# EAGLE design OSO-SCAP-A1-00 (EAGLE 9.4.2)
COMPANY: ADAFRUIT INDUSTRIES; DRAWN: KTOWN; REV: B
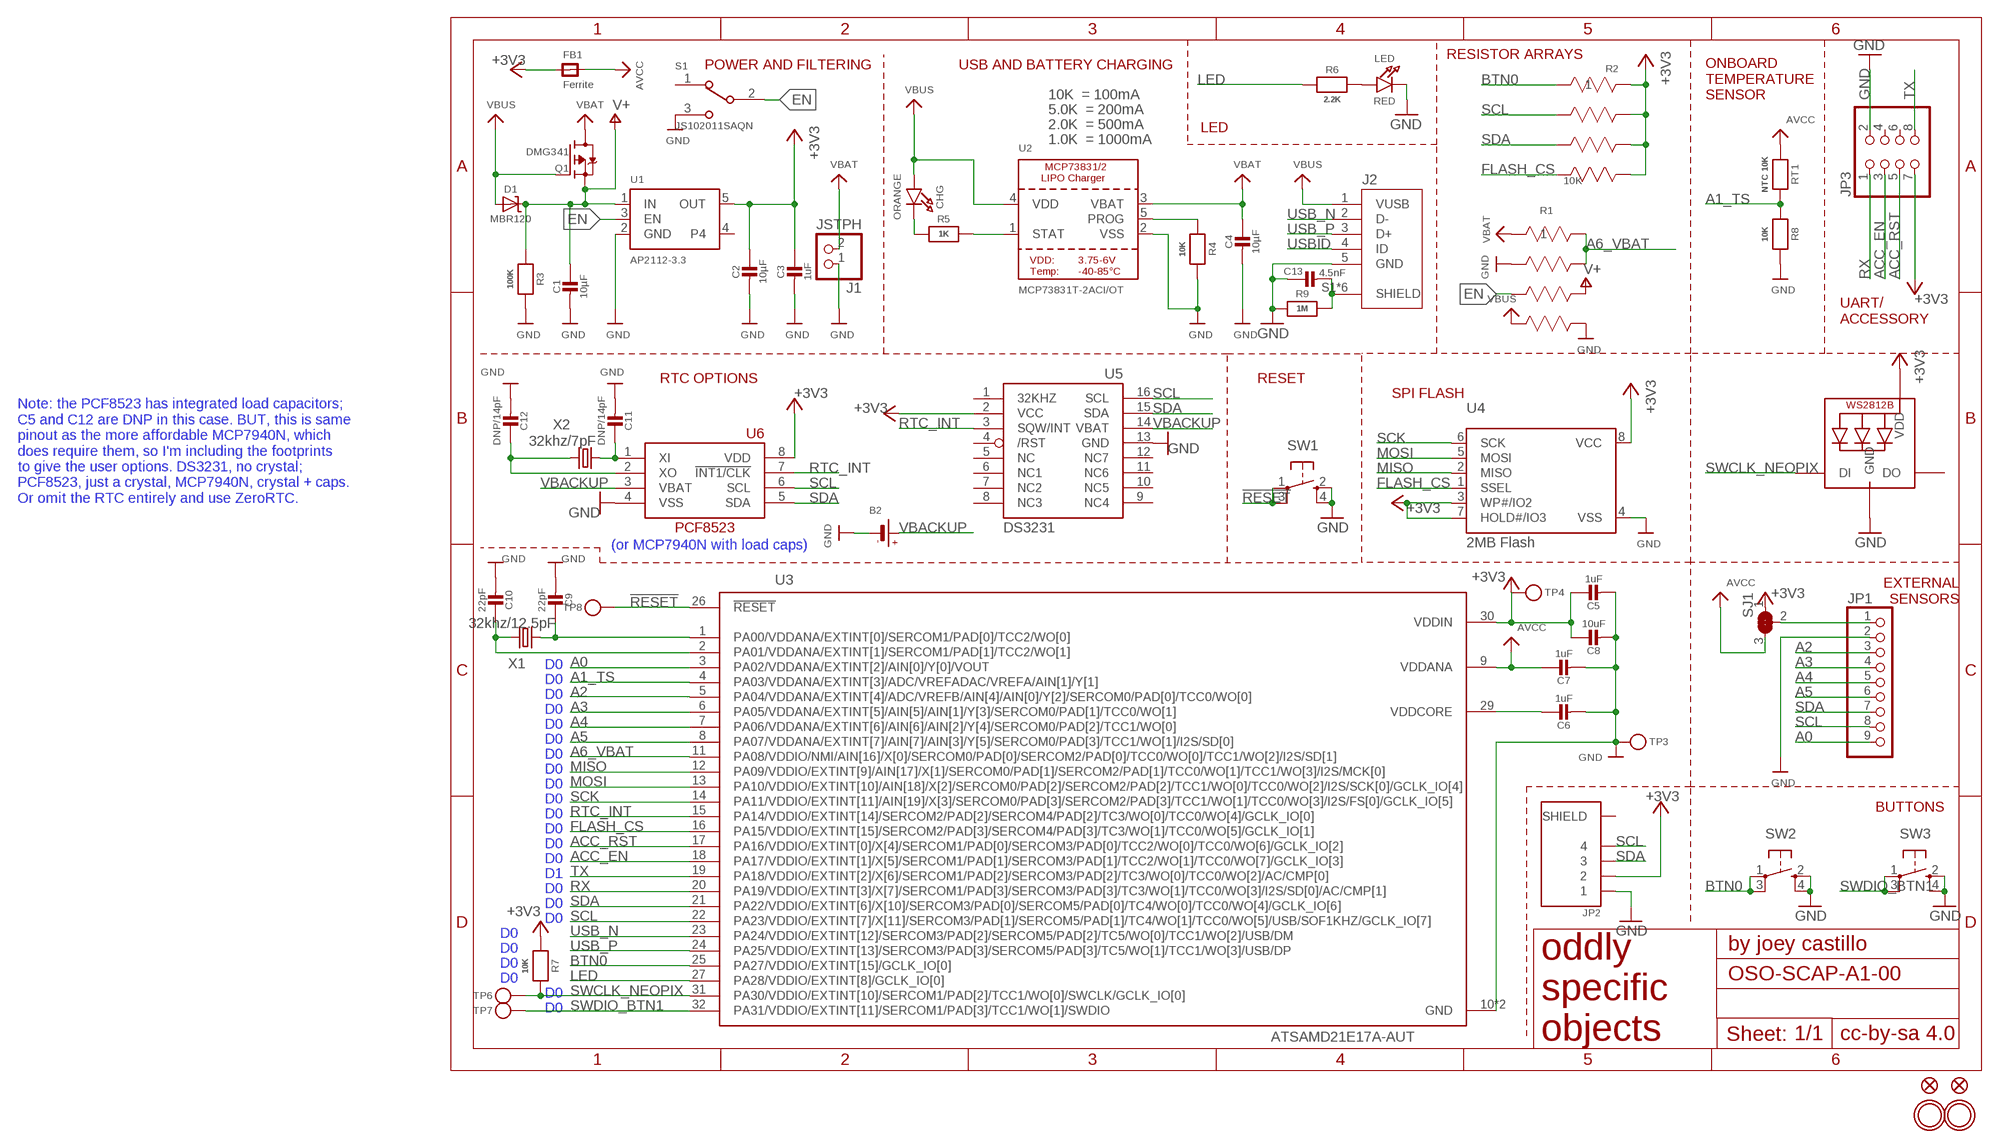
[diagram p0: schematic, sheet 1]

## Parts
B2  CR1220  BATTERYCR1220_2  [CR1220-2]
C1  10µF  CAP_CERAMIC0805_10MGAP  [0805_10MGAP]
C2  10µF  CAP_CERAMIC0805-NOOUTLINE  [0805-NO]
C3  1uF  CAP_CERAMIC0805-NOOUTLINE  [0805-NO]
C4  10µF  CAP_CERAMIC0805-NOOUTLINE  [0805-NO]
C5  1uF  CAP_CERAMIC0805-NOOUTLINE  [0805-NO]
C6  1uF  CAP_CERAMIC0805-NOOUTLINE  [0805-NO]
C7  1uF  CAP_CERAMIC0805-NOOUTLINE  [0805-NO]
C8  10uF  CAP_CERAMIC0805-NOOUTLINE  [0805-NO]
C9  22pF  CAP_CERAMIC0805-NOOUTLINE  [0805-NO]
C10  22pF  CAP_CERAMIC0805-NOOUTLINE  [0805-NO]
C11  DNP/14pF  CAP_CERAMIC0805_10MGAP  [0805_10MGAP]
C12  DNP/14pF  CAP_CERAMIC0805_10MGAP  [0805_10MGAP]
C13  4.5nF  CAP_CERAMIC0805-NOOUTLINE  [0805-NO]
CHG  ORANGE  LED0805_NOOUTLINE  [CHIPLED_0805_NOOUTLINE]
D1  MBR120  DIODE-SCHOTTKYSOD-123  [SOD-123]
FB1  Ferrite  FERRITE0805  [0805]
J1  JSTPH  CON_JST_PH_2PIN  [JSTPH2]
J2  10118193-0001LF  [FCI_10118193-0001LF]
JP1  HEADER-1X9_JSTSH  [JST_SH9]
JP2  SM04B-SRSS-TB(LF)(SN)  [JST_SM04B-SRSS-TB(LF)(SN)]
JP3  PINHD-2X4SMT  [PINHD_2X4_SMT]
LED  RED  LED0805_NOOUTLINE  [CHIPLED_0805_NOOUTLINE]
NEOPIX  WS2812B_4020  [WS2812B_4020]
Q1  DMG341  MOSFET-P  [SOT23-R]
R1  100K  EXB-V8V103JV  [EXBV8V]
R2  10K  EXB-V8V103JV  [EXBV8V]
R3  100K  RESISTOR0805_NOOUTLINE  [0805-NO]
R4  10K  RESISTOR0805_NOOUTLINE  [0805-NO]
R5  1K  RESISTOR0805_NOOUTLINE  [0805-NO]
R6  2.2K  RESISTOR0805_NOOUTLINE  [0805-NO]
R7  10K  RESISTOR0805_NOOUTLINE  [0805-NO]
R8  10K  RESISTOR0805_NOOUTLINE  [0805-NO]
R9  1M  RESISTOR0805_NOOUTLINE  [0805-NO]
RT1  NTC 10K  RESISTOR0805_NOOUTLINE  [0805-NO]
S1  JS102011SAQN  [SW_JS102011SAQN]
SJ1  SOLDERJUMPER_2WAY  [SOLDERJUMPER_2WAY_OPEN_NOPASTE]
SW1  SPST_TACT-KMR2  [KMR2]
SW2  SPST_TACT-KMR2  [KMR2]
SW3  SPST_TACT-KMR2  [KMR2]
TP3  TESTPOINTROUND2MMNO  [TESTPOINT_ROUND_2MM_NO]
TP4  TESTPOINTROUND2MMNO  [TESTPOINT_ROUND_2MM_NO]
TP6  TESTPOINTROUND2MMNO  [TESTPOINT_ROUND_2MM_NO]
TP7  TESTPOINTROUND2MMNO  [TESTPOINT_ROUND_2MM_NO]
TP8  TESTPOINTROUND2MMNO  [TESTPOINT_ROUND_2MM_NO]
U1  AP2112-3.3  VREG_SOT23-5  [SOT23-5]
U2  MCP73831T-2ACI/OT  MCP73831/2  [SOT23-5]
U3  ATSAMD21E17A-AUT  [QFP80P900X900X120-32N]
U4  2MB Flash  SPIFLASH_SOIC8208MIL  [SOIC8_208MIL]
U5  DS3231/SO  [SO16W]
U6  PCF8523T  RTC_PCF8523T  [SOIC8_150MIL]
U$31  MOUNTINGHOLE2.5  [MOUNTINGHOLE_2.5_PLATED]
U$32  MOUNTINGHOLE2.5  [MOUNTINGHOLE_2.5_PLATED]
U$34  FIDUCIAL""  [FIDUCIAL_1MM]
U$35  FIDUCIAL""  [FIDUCIAL_1MM]
X1  32khz/12.5pF  CRYSTAL7015  [XTAL-7015]
X2  32khz/7pF  CRYSTAL7015  [XTAL-7015]

## Nets
!RESET: SW1.1(P) SW1.3(P1) TP8.P$1 U3.26(!RESET)
+3V3 [power]: C2.1 C3.1 C5.1 C8.1 FB1.1 JP2.2 JP3.7 NEOPIX.2(VDD) R2.5 R2.6 R2.7 R2.8 R7.1 SJ1.1 TP4.P$1 U1.5(OUT) U3.30(VDDIN) U4.3(WP#/IO2) U4.7(HOLD#/IO3) U4.8(VCC) U5.2(VCC) U6.8(VDD)
A0: JP1.9 U3.3(PA02/VDDANA/EXTINT[2]/AIN[0]/Y[0]/VOUT)
A1_TS: R8.1 RT1.2 U3.4(PA03/VDDANA/EXTINT[3]/ADC/VREFADAC/VREFA/AIN[1]/Y[1])
A2: JP1.3 U3.5(PA04/VDDANA/EXTINT[4]/ADC/VREFB/AIN[4]/AIN[0]/Y[2]/SERCOM0/PAD[0]/TCC0/WO[0])
A3: JP1.4 U3.6(PA05/VDDANA/EXTINT[5]/AIN[5]/AIN[1]/Y[3]/SERCOM0/PAD[1]/TCC0/WO[1])
A4: JP1.5 U3.7(PA06/VDDANA/EXTINT[6]/AIN[6]/AIN[2]/Y[4]/SERCOM0/PAD[2]/TCC1/WO[0])
A5: JP1.6 U3.8(PA07/VDDANA/EXTINT[7]/AIN[7]/AIN[3]/Y[5]/SERCOM0/PAD[3]/TCC1/WO[1]/I2S/SD[0])
A6_VBAT: R1.7 R1.8 U3.11(PA08/VDDIO/NMI/AIN[16]/X[0]/SERCOM0/PAD[0]/SERCOM2/PAD[0]/TCC0/WO[0]/TCC1/WO[2]/I2S/SD[1])
ACC_EN: JP3.3 U3.18(PA17/VDDIO/EXTINT[1]/X[5]/SERCOM1/PAD[1]/SERCOM3/PAD[1]/TCC2/WO[1]/TCC0/WO[7]/GCLK_IO[3])
ACC_RST: JP3.5 U3.17(PA16/VDDIO/EXTINT[0]/X[4]/SERCOM1/PAD[0]/SERCOM3/PAD[0]/TCC2/WO[0]/TCC0/WO[6]/GCLK_IO[2])
AVCC: C7.1 FB1.2 RT1.1 SJ1.3 U3.9(VDDANA)
BTN0: R2.1 SW2.1(P) SW2.3(P1) U3.25(PA27/VDDIO/EXTINT[15]/GCLK_IO[0])
EN: R1.3 S1.2 U1.3(EN)
FLASH_CS: R2.4 U3.16(PA15/VDDIO/EXTINT[15]/SERCOM2/PAD[3]/SERCOM4/PAD[3]/TC3/WO[1]/TCC0/WO[5]/GCLK_IO[1]) U4.1(SSEL)
GND [gnd]: B2.- C1.2 C2.2 C3.2 C4.2 C5.2 C6.2 C7.2 C8.2 C9.2 C10.2 C11.2 C12.2 C13.1 J1.1 J2.5(GND) JP1.2 JP2.1 JP3.2 LED.C NEOPIX.4(GND) R1.2 R1.5 R3.2 R4.2 R8.2 R9.1 S1.3 SW1.2(S) SW1.4(S1) SW2.2(S) SW2.4(S1) SW3.2(S) SW3.4(S1) TP3.P$1 U1.2(GND) U2.2(VSS) U3.10(GND) U3.28(GND) U4.4(VSS) U5.13(GND) U6.4(VSS)
LED: R6.1 U3.27(PA28/VDDIO/EXTINT[8]/GCLK_IO[0])
MISO: U3.12(PA09/VDDIO/EXTINT[9]/AIN[17]/X[1]/SERCOM0/PAD[1]/SERCOM2/PAD[1]/TCC0/WO[1]/TCC1/WO[3]/I2S/MCK[0]) U4.2(MISO)
MOSI: U3.13(PA10/VDDIO/EXTINT[10]/AIN[18]/X[2]/SERCOM0/PAD[2]/SERCOM2/PAD[2]/TCC1/WO[0]/TCC0/WO[2]/I2S/SCK[0]/GCLK_IO[4]) U4.5(MOSI)
N$1: CHG.C R5.1
N$2: LED.A R6.2
POWER_OUT [power]: JP1.1 SJ1.2
PROG: R4.1 U2.5(PROG)
RTC_INT: U3.15(PA14/VDDIO/EXTINT[14]/SERCOM2/PAD[2]/SERCOM4/PAD[2]/TC3/WO[0]/TCC0/WO[4]/GCLK_IO[0]) U5.3(SQW/INT) U6.7(!INT1/CLK)
RX: JP3.1 U3.20(PA19/VDDIO/EXTINT[3]/X[7]/SERCOM1/PAD[3]/SERCOM3/PAD[3]/TC3/WO[1]/TCC0/WO[3]/I2S/SD[0]/AC/CMP[1])
SCK: U3.14(PA11/VDDIO/EXTINT[11]/AIN[19]/X[3]/SERCOM0/PAD[3]/SERCOM2/PAD[3]/TCC1/WO[1]/TCC0/WO[3]/I2S/FS[0]/GCLK_IO[5]) U4.6(SCK)
SCL: JP1.8 JP2.4 R2.2 U3.22(PA23/VDDIO/EXTINT[7]/X[11]/SERCOM3/PAD[1]/SERCOM5/PAD[1]/TC4/WO[1]/TCC0/WO[5]/USB/SOF1KHZ/GCLK_IO[7]) U5.16(SCL) U6.6(SCL)
SDA: JP1.7 JP2.3 R2.3 U3.21(PA22/VDDIO/EXTINT[6]/X[10]/SERCOM3/PAD[0]/SERCOM5/PAD[0]/TC4/WO[0]/TCC0/WO[4]/GCLK_IO[6]) U5.15(SDA) U6.5(SDA)
SHIELD: C13.2 J2.S1(SHIELD) J2.S2(SHIELD) J2.S3(SHIELD) J2.S4(SHIELD) J2.S5(SHIELD) J2.S6(SHIELD) R9.2
STAT: R5.2 U2.1(STAT)
SWCLK_NEOPIX: NEOPIX.1(DI) R7.2 TP6.P$1 U3.31(PA30/VDDIO/EXTINT[10]/SERCOM1/PAD[2]/TCC1/WO[0]/SWCLK/GCLK_IO[0])
SWDIO_BTN1: SW3.1(P) SW3.3(P1) TP7.P$1 U3.32(PA31/VDDIO/EXTINT[11]/SERCOM1/PAD[3]/TCC1/WO[1]/SWDIO)
TX: JP3.8 U3.19(PA18/VDDIO/EXTINT[2]/X[6]/SERCOM1/PAD[2]/SERCOM3/PAD[2]/TC3/WO[0]/TCC0/WO[2]/AC/CMP[0])
USB_N: J2.2(D-) U3.23(PA24/VDDIO/EXTINT[12]/SERCOM3/PAD[2]/SERCOM5/PAD[2]/TC5/WO[0]/TCC1/WO[2]/USB/DM)
USB_P: J2.3(D+) U3.24(PA25/VDDIO/EXTINT[13]/SERCOM3/PAD[3]/SERCOM5/PAD[3]/TC5/WO[1]/TCC1/WO[3]/USB/DP)
USBID: J2.4(ID)
V+ [power]: C1.1 D1.C Q1.2(S) R1.6 R3.1 U1.1(IN)
VBACKUP: B2.+ U5.14(VBAT) U6.3(VBAT)
VBAT [power]: C4.1 J1.2 Q1.3(D) R1.1 U2.3(VBAT)
VBUS [power]: CHG.A D1.A J2.1(VUSB) Q1.1(G) R1.4 U2.4(VDD)
VDDCORE: C6.1 U3.29(VDDCORE)
XIN32: C9.1 U3.1(PA00/VDDANA/EXTINT[0]/SERCOM1/PAD[0]/TCC2/WO[0]) X1.1
XIN_RTC: C11.1 U6.1(XI) X2.1
XOUT32: C10.1 U3.2(PA01/VDDANA/EXTINT[1]/SERCOM1/PAD[1]/TCC2/WO[1]) X1.4
XOUT_RTC: C12.1 U6.2(XO) X2.4
Unconnected: JP2.S1(SHIELD) JP2.S2(SHIELD) JP3.4 JP3.6 NEOPIX.3(DO) S1.1 U1.4 U5.1(32KHZ) U5.4(/RST) U5.5(NC) U5.6(NC1) U5.7(NC2) U5.8(NC3) U5.9(NC4) U5.10(NC5) U5.11(NC6) U5.12(NC7)

## Notes on the sheet
- RESISTOR ARRAYS
- POWER AND FILTERING | USB AND BATTERY CHARGING
- 10K  = 100mA
- ONBOARD
  TEMPERATURE
  SENSOR
- 5.0K  = 200mA
- 2.0K  = 500mA | LED
- 1.0K  = 1000mA
- UART/
  ACCESSORY
- RTC OPTIONS | RESET
- Note: the PCF8523 has integrated load capacitors; 
  C5 and C12 are DNP in this case. BUT, this is same 
  pinout as the more affordable MCP7940N, which 
  does require them, so I'm including the footprints 
  to give the user options. DS3231, no crystal; 
  PCF8523, just a crystal, MCP7940N, crystal + caps.
  Or omit the RTC entirely and use ZeroRTC.
- SPI FLASH
- (or MCP7940N with load caps)
- EXTERNAL
  SENSORS
- D0
- D0
- D0
- D0
- D0
- D0
- D0
- D0
- D0
- D0 | BUTTONS
- D0
- D0
- D0
- D0
- D1
- D0
- D0
- D0
- D0
- D0
- D0
- D0
- D0
- D0

## Library data of the parts
B2 = microbuilder:BATTERY: CR1220 SMT - Digikey: 3001K-ND CD2032 BAT-HLD-001 - Digikey: BAT-HLD-001-ND
C1-C13 = microbuilder:CAP_CERAMIC: Ceramic Capacitors For new designs, use the packages preceded by an '_' character since they are more reliable: The following footprints should be used on most boards: _0402 - Standard footprint for regular board layouts _0603 - Standard footprint for regular board layouts _0805 - Standard footprint for regular board layouts _1206 - Standard footprint for regular board layouts For extremely tight-pitch boards where space is at a premium, the following 'micro-pitch' footprints can be used (smaller pads, no silkscreen outline, etc.): _0402MP - Micro-pitch footprint for very dense/compact boards _0603MP - Micro-pitch footprint for very dense/compact boards _0805MP - Micro-pitch footprint for very dense/compact boards _1206MP - Micro-pitch footprint for very dense/compact boards
CHG LED = microbuilder:LED: LED 0603 - 0603 Surface Mount Package 2mA: Green LED - Low Power (3.9mcd, 2ma, 1.7Vf) - Digikey: 475-2709-2-ND Orange LED - Low Power (9.8mcd, 2ma, 1.8Vf) - Digikey: 475-1194-2-ND Red LED - Low Power (5mcd, 2ma, 1.8Vf) - Digikey: 475-1195-2-ND Yellow LED - Low Power (7mcd, 2ma, 1.8Vf) - Digikey: 475-1196-2-ND 5mA: Blue LED - Low Power (17mcd, 5ma, 2.9Vf) - Digikey: LNJ937W8CRACT-ND 0805 - 0805 Surface Mount Package 2mA: Red LED (8.8mcd, 2mA, 1.8Vf, Clear) - Low Power [Digikey: 475-2510-1-ND] Green LED (5mcd, 2mA, 1.8Vf, Clear) - Low Power [Digikey: 475-2730-1-ND] Yellow LED (11.3mcd, 2mA, 1.8Vf, Clear) - Low Power [Digikey: 475-2555-1-ND] 20mA: Red LED (104mcd, 20mA, Diffused) - LS R976 [Digikey: 475-1278-6-ND] Red LED (12mcd, 20mA, 2.0Vf, Clear) - APT2012EC [Digikey: 754-1128-1-ND] Green LED (15mcd, 20mA, 2.2Vf, Clear) - APT2012GC [Digikey: 754-1131-1-ND] Orange LED (160mcd, 20mA, 2.1Vf, Clear) - APT2012SECK [Digikey: 754-1130-1-ND] 1206 - 1206 Surface Mount Package Green LED (26mcd, 20mA, Diffused) - LG N971 [Digikey: 475-1407-6-ND] Red LED (15mcd, 20mA, Diffused) - LH N974 [Digikey: 475-1416-6-ND] Cree - Cree High-Power Surface Mount LEDs XPEBWT-L1-0000-00D50 - White 111lm 350mA 2.9Vf 6200K 110° XTEAWT-00-0000-00000LEE3 - White 114lm 350mA 2.85Vf 5000K 115° Everlight - Everlight 45-21 Series Surface Mount LEDs 45-21/QK2C-B2832AC2CB2/2T - Warm White 2000mcd 20mA 3.25Vf 3050K 120° 45-21/LK2C-B38452C4CB2/2T - Nuetral White 2000mcd 20mA 3.25Vf 4150K 120° 45-21/LK2C-B50634C6CB2/2T - Cold White 2200mcd 20mA 3.25Vf 5650K 120° PLCC2 Reverse Mount LS T77K-J1L2-1-0-2-R18-Z - Red 11.25mcd 2mA 1.8Vf 630nm 120° LO T77K-L1M2-24-Z - Orange 19.6mcd 2mA 1.8Vf 606nm 120° LY T77K-K2M1-26-Z - Yellow 15.7mcd 2mA 1.8Vf 587nm 120°
D1 = microbuilder:DIODE-SCHOTTKY
FB1 = microbuilder:FERRITE: Ferrite Bead 0603 MMZ1608B121C - 120 Ohm @ 100MHz, 600mA, 0.15 Ohm DC Resistance - Digikey: 445-2164-1-ND BK1608HW121-T - 120 Ohm, 600mA Ferrite Chip - Digikey: 587-1876-2-ND 0805 HZ0805B272R-10 - 2.7K Ohm @ 100MHz, 200mA, 0.8 Ohm DC Resistance - Digikey: 240-2504-1-ND (see also Murata BLM21BD272SN1L) MMZ2012Y152B - 1.5K Ohm @ 100MHz, 500mA, 0.4 Ohm DC Resistance - Digikey: 445-1560-1-ND - Mainly for high frequency (80-400MHz) MMZ2012R102A - 1K Ohm @ 100MHz, 500mA, 0.3 Ohm DC Resistance - Digikey: 445-1555-2-ND - More general purpose (10-200MHz)
J1 = microbuilder:CON_JST_PH_2PIN: JST 2-Pin Right-Angle Connector PH-Series - 4UConnector: 17311 SH-Series - 4UConnector: 07278
J2 = 10118193-0001LF:10118193-0001LF: Micro USB B Type Receptacle; DESCRIPTION: Single Port 5 Contact Shielded SMT MICRO USB B-Type Receptacle; DIGI-KEY_PART_NUMBER: 609-4616-1-ND; DIGI-KEY_PURCHASE_URL: https://www.digikey.com/product-detail/en/amphenol-icc-fci/10118193-0001LF/609-4616-1-ND/2785380?utm_source=snapeda&utm_medium=aggregator&utm_campaign=symbol; MF: Amphenol ICC; MP: 10118193-0001LF; PACKAGE: None
JP1 = microbuilder:HEADER-1X9: PIN HEADER
JP2 = SM04B-SRSS-TB_LF__SN_:SM04B-SRSS-TB(LF)(SN): SH Series 1.0 mm Pitch 2 Position Single Row Side Entry Shrouded Header; DESCRIPTION: SH Series 1.0 mm Pitch 2 Position Single Row Side Entry Shrouded Header; DIGI-KEY_PART_NUMBER: 455-1804-1-ND; DIGI-KEY_PURCHASE_URL: https://www.digikey.com/product-detail/en/jst-sales-america-inc/SM04B-SRSS-TB_LF__SN_/455-1804-1-ND/926875?utm_source=snapeda&utm_medium=aggregator&utm_campaign=symbol; MF: JST Sales; MP: SM04B-SRSS-TB_LF__SN_; PACKAGE: None
JP3 = My Stuff:PINHD-2X4: PIN HEADER
NEOPIX = microbuilder:WS2812B
Q1 = microbuilder:MOSFET-P: P-Channel Mosfet LEGEND VDS: Voltage Drain-Source ID: Drain Current RDS(ON): Drain-Source On-State Resistance VGS(TH): Gate-Source Threshold Voltage CISS: Drain-Source Input Capacitance SOT-23 Name VDS ID RDS(ON) VGS(TH) CISS Order Number IRLML5103 30V 760mA 600 mOhm -- 75pF @ 25V Digikey: IRLML5103PBFCT-ND IRLML6401 12V 4.3A 50 mOhm 950mV @ 250µA 830pF @ 10V Digikey: IRLML6401PBFTR-ND NTR0202PL 20V 400mA 800 mOhm 2.3V @ 250uA 70pF @ 5V Digikey: NTR0202PLT1GOSTR-ND NTR4101PT1G 20V 1.8A 85 mOhm 1.2V @ 250uA 675pF @ 10V Digikey: NTR4101PT1GOSCT-ND DMP2004K 20V 600mA 900 mOhm 1V @ 250uA 175pF @ 16V Digikey: DMP2004KDICT-ND PMV65XP 20V 3.9A 76 mOhm 950mV @ 1mA 725pF @ 20V Digikey: 568-2358-2-ND TO-252 Name VDS ID RDS(ON) VGS(TH) CISS Order Number AOD417 30V 25A 34 mOhm 3V @ 250µA 920pF @ 15V Digikey: 785-1106-2-ND PowerPak Name VDS ID RDS(ON) VGS(TH) CISS Order Number AON7401 30V 12A 14 mOhm 3V @ 250µA 2600pF @ 15V Digikey: 785-1302-1-ND
R1 R2 = resistor array:EXB-V8V103JV; MANUFACTURER_PART_NUMBER: EXBV8V103JV; VENDOR: Panasonic
R3-R9 RT1 = microbuilder:RESISTOR: Resistors For new designs, use the packages preceded by an '_' character since they are more reliable: The following footprints should be used on most boards: _0402 - Standard footprint for regular board layouts _0603 - Standard footprint for regular board layouts _0805 - Standard footprint for regular board layouts _1206 - Standard footprint for regular board layouts For extremely tight-pitch boards where space is at a premium, the following 'micro-pitch' footprints can be used (smaller pads, no silkscreen outline, etc.): _0402MP - Micro-pitch footprint for very dense/compact boards _0603MP - Micro-pitch footprint for very dense/compact boards _0805MP - Micro-pitch footprint for very dense/compact boards _1206MP - Micro-pitch footprint for very dense/compact boards
S1 = JS102011SAQN:JS102011SAQN: JS10 Series SPDT On-On 6 V 0.3 A Gull Wing SMT Slide Switch http://www.snapeda.com/parts/JS102011SAQN/C%26K%20Components/view-part/; DESCRIPTION: Slide Switch SPDT Surface Mount, Right Angle; DIGI-KEY_PART_NUMBER: 401-1999-1-ND; DIGI-KEY_PURCHASE_URL: https://www.digikey.com/product-detail/en/c-k/JS102011SAQN/401-1999-1-ND/1640114?utm_source=snapeda&utm_medium=aggregator&utm_campaign=symbol; MF: C&K; MP: JS102011SAQN; PACKAGE: None
SJ1 = pygamer-microbuilder:SOLDERJUMPER_2WAY: 2-Way Solder Jumper
SW1-SW3 = adafruit:SPST_TACT: SMT 6mm switch, EVQQ2 series http://www.ladyada.net/library/eagle
TP3 TP4 TP6-TP8 = microbuilder:TESTPOINT: Test Point Various test points for characterisation and PCB testing TESTPOINT_SMT - Compact Surface Mount Test Point [Digikey: 5016KTR-ND]
U1 = microbuilder:VREG_SOT23-5: SOT23-5 Fixed Voltage Regulators Part Current Out V Out V In V Dropout θJA (°C/W) TJ (°C) Digikey Part No. ADP121 150mA 3.3V 3.4-5.5V 0.09V @ 150mA -- -- ADP121-AUJZ33R7CT-ND ADP121 150mA 3.0V 3.1-5.5V 0.09V @ 150mA -- -- ADP121-AUJZ30R7CT-ND ADP122 300mA 3.3V 3.4-5.5V 0.085V @ 300mA -- -- ADP122AUJZ-3.3-R7CT-ND ADP1712 300mA 3.3V 3.5-5.5V 0.17V @ 300mA -- -- ADP1712AUJZ-3.3-R7TR-ND AP7311 (Low Cost) 150mA 3.3V 3.5-6V 0.15V @ 150mA -- -- AP7311-33WG-7DICT-ND LD39015M18R 150mA 1.8V 1.9V-5.5V 0.08V @ 100mA -- -- 497-6977-1-ND LP2985A-33DBVR 150mA 3.3V 3.3-16V 0.28V @ 150mA 206 150 296-18479-1-ND MCP1824T-3302E/OT 300mA 3.3V 3.5V-6V 0.2V @ 300mA -- -- MCP1824T-3302E/OTCT-ND MIC5205-2.5YM5 TR 150mA 2.5V 2.7-16V 0.165V @ 150mA -- -- 576-1257-2-ND MIC5205-3.0YM5 TR 150mA 3.0V 3.2V-16V 0.165V @ 150mA -- -- 576-1258-2-ND MIC5205-3.3YM5 TR 150mA 3.3V 3.5V-16V 0.165V @ 150mA -- -- 576-1259-2-ND TPS780330220 150mA 3.3V+2.2V 3.6-5.5V 250mV Max -- -- 296-23332-1-ND TDA3663/N1,135 100mA 3.3V 3.5-45V 0.18V @ 50mA -- -- 568-5343-1-ND Max operating temp can be calculated using θJA, TJ (max junction temperature), and power in watts. Set the "Maximum Ambient Temperature" until it reaches TJ ("Max Junction Temperature"), which is the absolute limit for safe use of the regulator: Heat Sink Temperature Calculator <http://www.daycounter.com/Calculators/Heat-Sink-Temperature-Calculator.phtml> For example, With 12V source into a 3.3V LP2985 and a 30mA load, we are dissipating (12V-3.3V) * 0.03A = 0.261W. With a θJA of 206 °C/W, a TJ of 150°C, and 261mW we can safely use the chip without a heat sink up to 75°C (=147.1°C Junction Temperature).
U2 = microbuilder:MCP73831/2: MCP73831/2 LIPO Charger VDD: 3.75 - 6V Temp -40 - 85°C Programmable Charge Rate: 15-500mA NOTE: STAT is a tri-state logic output on the MCP73831 and an open-drain output on the MCP73832. SOT23-5 with 4.2V output and tri-state logic on STAT = MCP73831T-2ACI/OT
U3 = ATSAMD21E17A-AUT:ATSAMD21E17A-AUT: Cortex-M0+, 128KB FLASH, 16KB SRAM, USB, DMA - 32TQFP IND TEMP, GREEN, 1.6-3.6V, 48MHz/ TQFP (A); DESCRIPTION: ARM® Cortex®-M0+ SAM D21E Microcontroller IC 32-Bit 48MHz 128KB _128K x 8_ FLASH 32-TQFP _7x7_; DIGI-KEY_PART_NUMBER: ATSAMD21E17A-AUTCT-ND; DIGI-KEY_PURCHASE_URL: https://www.digikey.com/product-detail/en/microchip-technology/ATSAMD21E17A-AUT/ATSAMD21E17A-AUTCT-ND/4878881?utm_source=snapeda&utm_medium=aggregator&utm_campaign=symbol; MF: Microchip; MP: ATSAMD21E17A-AUT; PACKAGE: TQFP-32 Microchip
U4 = microbuilder:SPIFLASH_SOIC8: SOIC8 SPI Flash Be careful with the size since SOIC8 flash comes in several 'widths' SOIC8 150 mil M25P16 - 16Mbit (2Mbit x 8) Serial Flash (75MHz SPI Bus), Supply: 2.7-3.6V Digikey: SOIC8 - M25P16-VMN6P-ND SOIC8 208 mil W25Q16BVSSIG - 16Mbit (2Mbit x 8) Serial Flash (104MHz SPI Bus), Supply: 2.7-3.6V Digikey: SOIC8 - W25Q16BVSSIG-ND
U5 = adafruit:DS3231
U6 = microbuilder:RTC_PCF8523
U$31 U$32 = microbuilder:MOUNTINGHOLE: Mounting Hole For #2 screws (0.086"/2.18mm width, 0.094"/2.4mm hole) use 2.5mm; BOM: EXCLUDE
U$34 U$35 = microbuilder:FIDUCIAL: Fiducial Alignment Points Various fiducial points for machine vision alignment.; BOM: EXCLUDE
X1 X2 = My Stuff:CRYSTAL: CRYSTAL

## Net classes
0 default: width 0.152 mm, drill 0.254 mm
1 power: width 0.305 mm, drill 0.305 mm

## Board
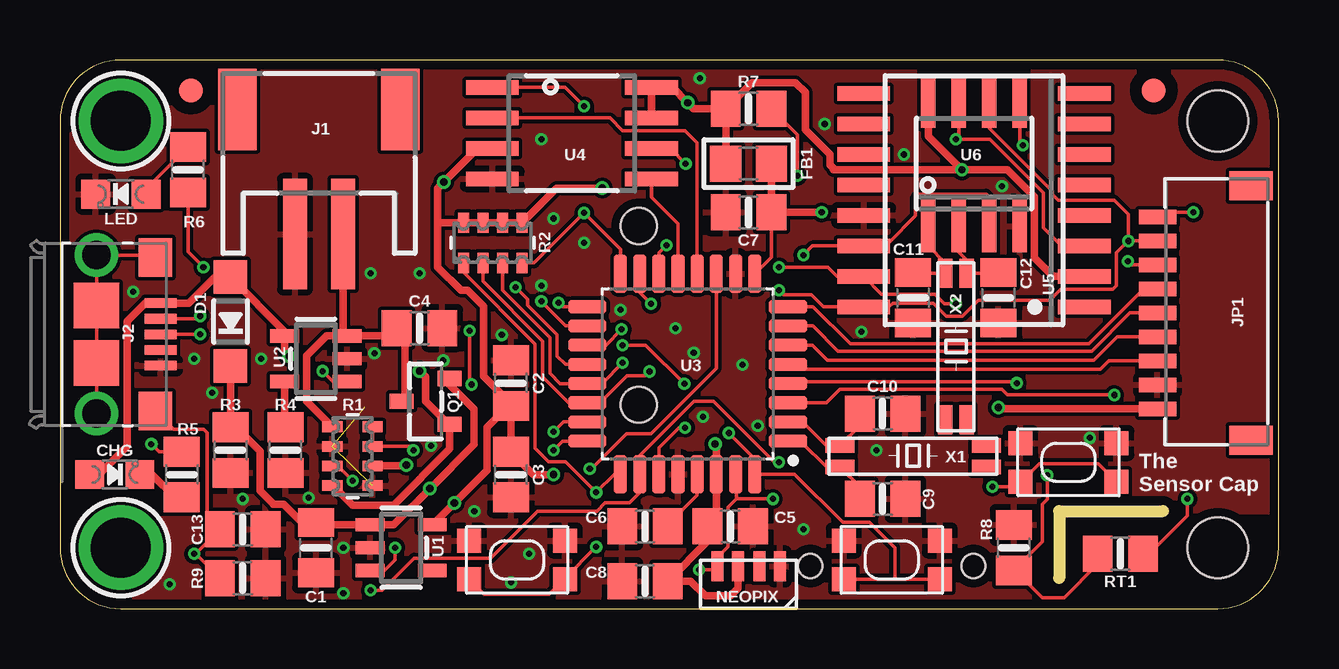
[diagram p1: board, top side]
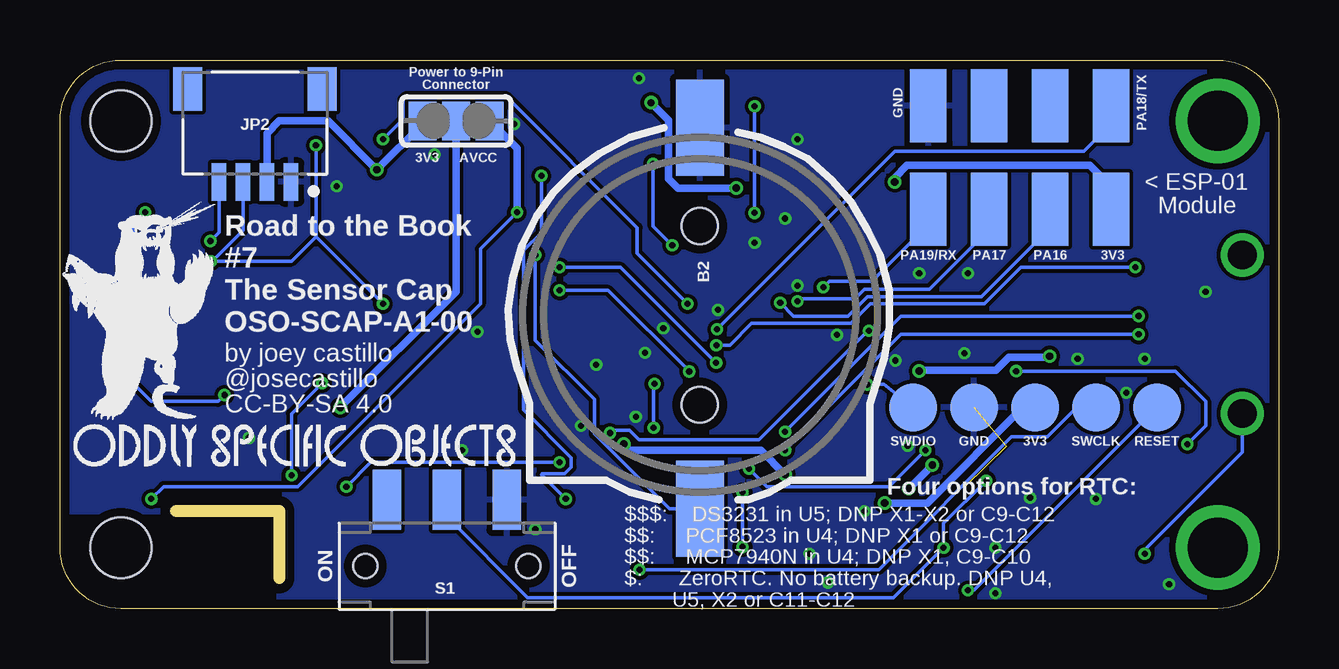
[diagram p2: board, bottom side, seen from below]

Size 50.8 x 22.86 mm. Coordinates in mm from the lower left corner, seen from the top.
Outline: 41.66,1.27 41.66,4.06 45.97,4.06
Outline: 2.54,0 48.26,0 arc90 50.8,2.54 50.8,20.32 arc90 48.26,22.86 2.54,22.86 arc90 0,20.32 0,2.54 arc90 2.54,0
Copper layers (1*16): Top 0.035559375mm / dielectric 1.6mm / Bottom 0.035559375mm
Design rules "oshpark-2layer *": minimum track width 6mil, minimum drill 10mil, track to track 6mil, track to pad 6mil, pad to pad 6mil, via to via 6mil, smd to smd 6mil, copper to edge 15mil, drill to drill 6mil, minimum pad ring 5mil, minimum via ring 5mil, stop-mask expansion 2.5mil, vias tented up to drill 12mil, thermal gap 10mil
Holes 2.54 mm at 48.26,20.32 48.26,2.54

### Footprints (pad centres in the part's own frame; a part is rotated, then mirrored left to right if it is on the bottom)
CR1220-2 = smd 4 x 2: + 8.29,0; - -7.6,0 | hole 1.5: 3.95,0; -3.5,0
0805_10MGAP = smd 1.2 x 1.5: 1 -1.05,0; 2 1.05,0
0805-NO = smd 1.24 x 1.5: 1 -0.95,0; 2 0.95,0
CHIPLED_0805_NOOUTLINE = smd 1.2 x 1.2: A 0,-1.05; C 0,1.05
SOD-123 = smd 1.4 x 1.4: A 1.85,0; C -1.85,0
0805 = smd 1.3 x 1.5: 1 -0.95,0; 2 0.95,0
JSTPH2 = smd 1 x 4.6: 1 -1,-3.7; 2 1,-3.7 | smd 1.6 x 3.4: NC1 -3.4,1.5; NC2 3.4,1.5
FCI_10118193-0001LF = smd 0.4 x 1.35: 1 -1.3,2.675; 2 -0.65,2.675; 3 0,2.675; 4 0.65,2.675; 5 1.3,2.675 | smd 1.6 x 1.4: S1 -3.2,2.45; S2 3.2,2.45 | smd 1.9 x 1.9: S3 1.2,0; S4 -1.2,0 | drill 1.2: S5 3.302,0; S6 -3.302,0
JST_SH9 = smd 0.6 x 1.55: 1 -4,2.514; 2 -3,2.514; 3 -2,2.514; 4 -1,2.514; 5 0,2.514; 6 1,2.514; 7 2,2.514; 8 3,2.514; 9 4,2.514 | smd 1.2 x 1.8: MT1 -5.3,-1.386; MT2 5.3,-1.386
JST_SM04B-SRSS-TB(LF)(SN) = smd 0.6 x 1.55: 1 -1.5,0; 2 -0.5,0; 3 0.5,0; 4 1.5,0 | smd 1.2 x 1.8: S1 -2.8,-3.875; S2 2.8,-3.875
PINHD_2X4_SMT = smd 1.524 x 3.048: 1 -3.81,-2.159; 2 -3.81,2.159; 3 -1.27,-2.159; 4 -1.27,2.159; 5 1.27,-2.159; 6 1.27,2.159; 7 3.81,-2.159; 8 3.81,2.159
WS2812B_4020 = smd 0.5 x 1.25: 1 1.3,-0.75; 2 0.45,-0.75; 3 -0.45,-0.75; 4 -1.3,-0.75
SOT23-R = smd 0.635 x 1.016: 1 -0.95,-1; 2 0.95,-1; 3 0,1
EXBV8V = smd 0.838 x 0.457: 1 -0.838,1.219; 2 -0.838,0.406; 3 -0.838,-0.406; 4 -0.838,-1.219; 5 0.838,-1.219; 6 0.838,-0.406; 7 0.838,0.406; 8 0.838,1.219
SW_JS102011SAQN = smd 1.2 x 2.5: 1 -2.5,2.75; 2 0,2.75; 3 2.5,2.75 | hole 1: -3.4,0; 3.4,0
SOLDERJUMPER_2WAY_OPEN_NOPASTE = smd 1.168 x 1.6: 1 -1.397,0; 2 0,0; 3 1.397,0
KMR2 = smd 1 x 1: 1 2,0.8; 2 2,-0.8; 3 -2,0.8; 4 -2,-0.8
TESTPOINT_ROUND_2MM_NO = smd 2 x 2: P$1 0,0
SOT23-5 = smd 0.55 x 1.2: 1 -0.95,-1.3; 2 0,-1.3; 3 0.95,-1.3; 4 0.95,1.3; 5 -0.95,1.3
QFP80P900X900X120-32N = smd 1.6 x 0.55: 1 -4.18,2.8; 2 -4.18,2; 3 -4.18,1.2; 4 -4.18,0.4; 5 -4.18,-0.4; 6 -4.18,-1.2; 7 -4.18,-2; 8 -4.18,-2.8; 17 4.18,-2.8; 18 4.18,-2; 19 4.18,-1.2; 20 4.18,-0.4; 21 4.18,0.4; 22 4.18,1.2; 23 4.18,2; 24 4.18,2.8 | smd 0.55 x 1.6: 9 -2.8,-4.18; 10 -2,-4.18; 11 -1.2,-4.18; 12 -0.4,-4.18; 13 0.4,-4.18; 14 1.2,-4.18; 15 2,-4.18; 16 2.8,-4.18; 25 2.8,4.18; 26 2,4.18; 27 1.2,4.18; 28 0.4,4.18; 29 -0.4,4.18; 30 -1.2,4.18; 31 -2,4.18; 32 -2.8,4.18
SOIC8_208MIL = smd 0.6 x 2.2: 1 -1.905,-3.315; 2 -0.635,-3.315; 3 0.635,-3.315; 4 1.905,-3.315; 5 1.905,3.315; 6 0.635,3.315; 7 -0.635,3.315; 8 -1.905,3.315
SO16W = smd 0.6 x 2.2: 1 -4.445,-4.6; 2 -3.175,-4.6; 3 -1.905,-4.6; 4 -0.635,-4.6; 5 0.635,-4.6; 6 1.905,-4.6; 7 3.175,-4.6; 8 4.445,-4.6; 9 4.445,4.6; 10 3.175,4.6; 11 1.905,4.6; 12 0.635,4.6; 13 -0.635,4.6; 14 -1.905,4.6; 15 -3.175,4.6; 16 -4.445,4.6
SOIC8_150MIL = smd 0.6 x 2.2: 1 -1.905,-2.6; 2 -0.635,-2.6; 3 0.635,-2.6; 4 1.905,-2.6; 5 1.905,2.6; 6 0.635,2.6; 7 -0.635,2.6; 8 -1.905,2.6
MOUNTINGHOLE_2.5_PLATED = drill 2.5 pad 3.2: P$1 0,0
FIDUCIAL_1MM = smd 1 x 1: 1 0,0
XTAL-7015 = smd 1.2 x 0.6: 1 -3.05,-0.45; 2 3.05,-0.45; 3 3.05,0.45; 4 -3.05,0.45

### Placement (x,y rotation side)
B2  24.13,12.45 270 bottom
C1  10.67,2.54 270 top
C2  18.8,9.4 90 top
C3  18.8,5.59 270 top
C4  14.99,11.68 0 top
C5  27.94,3.43 0 top
C6  24.38,3.43 180 top
C7  28.7,16.51 180 top
C8  24.38,1.14 180 top
C9  34.29,4.57 0 top
C10  34.29,8.13 0 top
C11  35.56,12.95 270 top
C12  39.12,12.95 270 top
C13  7.62,3.3 180 top
CHG  2.29,5.59 270 top
D1  7.11,11.96 90 top
FB1  28.7,18.54 0 top
J1  10.79,19.3 0 top
J2  1.52,11.43 270 top
JP1  48.26,12.32 90 top
JP2  42.67,17.78 180 bottom
JP3  10.79,18.8 0 bottom
LED  2.54,17.27 90 top
NEOPIX  28.7,1.02 180 top
Q1  15.24,8.64 90 top
R1  12.19,6.35 0 top
R2  18.03,15.24 90 top
R3  7.11,6.6 270 top
R4  9.4,6.6 270 top
R5  5.08,5.59 90 top
R6  5.33,18.29 90 top
R7  28.7,20.83 0 top
R8  39.75,2.54 90 top
R9  7.62,1.27 180 top
RT1  44.2,2.29 180 top
S1  34.67,1.78 0 bottom
SJ1  34.29,20.32 0 bottom
SW1  42.04,6.1 180 top
SW2  19.05,2.03 180 top
SW3  34.67,2.03 180 top
TP3  12.7,8.38 0 bottom
TP4  10.16,8.38 0 bottom
TP6  7.62,8.38 0 bottom
TP7  15.24,8.38 0 bottom
TP8  5.08,8.38 0 bottom
U1  14.22,2.54 270 top
U2  10.67,10.41 90 top
U3  26.16,9.78 180 top
U4  21.34,19.81 270 top
U5  38.1,17.02 90 top
U6  38.1,18.54 0 top
U$24  [OSO_WORDMARK_ONELINE_725MIL_1000DPI]  50.29,5.84 0 bottom
U$25  [OSO_BEAR_250X360MIL_1000DPI]  47.5,12.45 0 bottom
U$31  2.54,20.32 270 top
U$32  2.54,2.54 270 top
U$34  5.46,21.59 270 top
U$35  45.59,21.59 270 top
X1  35.56,6.35 0 top
X2  37.34,10.92 270 top

### Tracks (layer width: path | path; a pad name or v marks a point on that pad's centre or on a via)
!RESET  (via drill 0.25)
  Top 0.152: SW1.1 40.07,5.3 | SW1.3 43.29,6.04 40.82,6.04 40.07,5.3 | v29.97,6.1 29.78,6.1 27.24,8.64 26.43,8.64 24.16,6.37 U3.26 24.16,4.83 23.74,4.41 22.72,4.41 22.38,4.06 19.91,4.06 17.95,2.1 14.76,2.1 13.42,0.76 v12.95,0.76 | v38.86,5.08 39.86,5.08 40.07,5.3
  Bottom 0.152: v29.97,6.1 37.85,6.1 v38.86,5.08 | TP8.P$1 12.7,0.76 v12.95,0.76
+3V3  (via drill 0.3)
  Top 0.305: U1.5 v16.43,4.4 17.81,5.78 17.81,7.55 18.7,8.45 C2.1 | C2.1 C3.1 19.75,5.59 v20.57,5.59 | v27.3,6.86 27.36,6.8 U3.30 27.36,3.8 C5.1 26.99,2.8 C8.1 26.29,1.14 26.9,0.53 27.94,0.53 28.25,0.84 NEOPIX.2 | C2.1 18.8,8.55 17.66,9.68 17.66,12.59 17,13.26 16.71,13.26 15.75,14.22 15.75,16.08 | 15.75,16.08 R2.8 R2.7 R2.6 R2.5 20.7,17.53 v22.61,17.53 | U4.3 17.4,19.18 v16,17.78 15.75,17.53 15.75,16.08 | U4.7 U4.8 25.53,21.72 v26.16,21.08 26.42,20.83 R7.1 | U6.8 36.2,19.68 v37.59,18.29 | U5.2 41.38,13.84 40.61,14.61 40.61,17.17 39.49,18.29 v37.59,18.29 | v37.59,18.29 32.24,18.29 32.24,18.35 32.09,18.5 32.09,18.93 31.06,19.96 31.06,21.51 30.66,21.92 28.84,21.92 R7.1 | R7.1 FB1.1
  Bottom 0.305: v27.3,6.86 27.05,6.6 21.59,6.6 v20.57,5.59 | v26.16,21.08 25.43,20.36 25.43,17.92 25.04,17.53 v22.61,17.53 | SJ1.1 35.69,20.19 v37.59,18.29 39.62,20.32 41.66,20.32 42.17,19.8 JP2.2 | v16,17.78 16,17.96 15.49,18.47 7.88,18.47 6.99,17.58 JP3.7 | TP4.P$1 10.67,8.38 14.65,4.4 v16.43,4.4
A0  (via drill 0.25)
  Top 0.152: U3.3 31.95,8.58 32.51,9.14 39.26,9.14 39.5,8.9 v43.94,8.9 | JP1.9 46.25,16.32 46.45,16.51 v47.24,16.51
  Bottom 0.152: v43.94,8.9 44.21,8.64 46.99,8.64 47.75,9.4 47.75,16 v47.24,16.51
A1_TS  (via drill 0.25)
  Top 0.152: RT1.2 43.25,1.84 41.86,0.46 40.95,0.46 39.81,1.59 R8.1 40.95,2.78 40.95,4.36 41.15,4.56 v41.15,5.56 | v39.88,9.4 39.83,9.45 30.41,9.45 U3.4
  Bottom 0.152: v39.88,9.4 41.15,8.13 v41.15,5.56
A2
  Top 0.152: U3.5 30.55,9.97 43.36,9.97 43.71,10.32 JP1.3
A3
  Top 0.152: JP1.4 44.08,11.32 43.1,10.34 31.99,10.34 31.36,10.98 U3.6
A4
  Top 0.152: JP1.5 44.6,12.32 43.01,10.72 32.43,10.72 31.38,11.78 U3.7
A5
  Top 0.152: U3.8 31.39,12.58 32.94,11.03 42.88,11.03 45.17,13.32 JP1.6
A6_VBAT  (via drill 0.25)
  Top 0.152: R1.8 R1.7 14.58,6.76 v14.73,6.6 | v22.09,5.83 22.15,5.83 23.61,7.29 24.63,7.29 25.05,7.71 25.69,8.35 27.36,10.02 U3.11
  Bottom 0.152: v22.09,5.83 21.34,5.08 16.26,5.08 v14.73,6.6
ACC_EN  (via drill 0.25)
  Top 0.152: v20.07,12.8 20.07,12.78 21.07,11.78 U3.18
  Bottom 0.152: JP3.3 12.06,15.81 14.56,13.31 17.27,13.31 17.66,12.91 19.95,12.91 v20.07,12.8
ACC_RST  (via drill 0.25)
  Top 0.152: U3.17 20.95,12.58 v20.78,12.75
  Bottom 0.152: v20.78,12.75 20.22,12.19 17.95,12.19 17.14,13.01 12.39,13.01 9.53,15.88 JP3.5
AVCC  (via drill 0.25)
  Top 0.152: C7.1 29.65,14.65 U3.9 | v46.99,4.57 46.99,3.88 45.4,2.29 RT1.1
  Top 0.305: FB1.2 C7.1 v31.75,16.51
  Bottom 0.152: v31.75,16.51 33.27,14.99 33.27,12.7 40.89,5.08 46.48,5.08 v46.99,4.57
  Bottom 0.305: SJ1.3 31.75,19.18 v31.75,16.51
BTN0  (via drill 0.25)
  Top 0.152: SW2.3 21.05,1.27 | 21.05,1.27 v22.35,2.57 | U3.25 23.11,5.6 v22.35,4.84 21.07,6.12 20.37,6.12 19.81,6.68 19.81,11.03 16.82,14.02 R2.1 | SW2.1 17.68,0.6 20.38,0.6 21.05,1.27
  Bottom 0.152: v22.35,2.57 v22.35,4.84
EN  (via drill 0.25)
  Top 0.152: v12.19,5.33 11.58,5.94 R1.3 | v13.97,2.54 13.97,2.03 13.53,1.59 U1.3
  Bottom 0.152: v12.19,5.33 13.97,3.56 v13.97,2.54 16.05,0.46 31.3,0.46 34.67,3.82 S1.2
FLASH_CS  (via drill 0.25)
  Top 0.152: U3.16 23.36,14.97 v21.85,16.49 19.76,14.4 R2.4 | U4.1 21.06,21.72 v21.84,20.93
  Bottom 0.152: v21.84,20.93 v21.84,16.49 v21.85,16.49
GND  (via drill 0.25)  (2 unrouted)
  other vias: 20.07,19.56 20.57,16.26 21.84,15.24 20.07,13.46 14.99,13.97 12.95,13.97 13.11,10.64 8.38,10.41 3.05,13.21 6.35,8.99 5.59,10.41 11.81,2.54 7.62,4.57 4.57,1.02 11.81,0.64 23.37,12.45 26.42,10.67 31.88,20.19 35.18,18.92 28.45,10.16 30.99,3.3 26.8,8 15.98,10.34 18.41,11.4 25.65,11.68 17.27,4.06 19.56,2.29 34.04,6.6 33.4,11.53 29.08,7.62 18.8,1.09 15.47,6.78 39.27,17.6 42.93,7.11 10.36,4.62 26.67,22.1
  pour Top: 0,22.86 0,0 41.66,0 41.66,4.06 50.93,4.06 50.93,22.86
  pour Bottom: 50.93,4.06 41.66,4.06 41.66,0 0,0 0,22.86 50.93,22.86
LED  (via drill 0.25)
  Top 0.152: U3.27 24.96,6.71 25.8,7.54 v26.05,7.54 | v5.98,14.22 5.33,14.87 R6.1 | v26.02,9.36 24.41,10.98 v23.44,10.98
  Bottom 0.152: v26.05,7.54 26.05,9.34 v26.02,9.36 | v5.98,14.22 10.74,14.22 12.27,12.7 17.02,12.7 17.83,11.89 21.97,11.89 22.88,10.98 v23.44,10.98
MISO
  Top 0.152: U4.2 22.93,20.45 23.46,19.92 26.06,19.92 26.56,19.41 U3.12
MOSI
  Top 0.152: U3.13 25.76,16.03 24.65,17.14 U4.5
N$1
  Top 0.305: CHG.C 3.84,5.59 4.79,4.64 R5.1
N$2
  Top 0.152: R6.2 3.59,17.49 LED.A
POWER_OUT  (via drill 0.3)
  Top 0.305: JP1.1 39.18,8.32 v39.12,8.38
  Bottom 0.305: SJ1.2 34.29,13.21 v39.12,8.38
PROG
  Top 0.305: U2.5 9.37,7.58 R4.1
RTC_INT  (via drill 0.25)
  Top 0.152: U3.15 24.16,13.18 v24.64,12.7 | U6.7 37.47,19.68 v37.34,19.56 38.76,19.56 40.99,17.33 40.99,15.86 41.74,15.11 U5.3
  Bottom 0.152: v24.64,12.7 26.75,14.81 26.75,15.88 32.21,21.35 36.37,21.35 36.5,21.21 36.5,20.4 v37.34,19.56
RX  (via drill 0.25)
  Top 0.152: U3.20 21.06,10.18 20.73,10.52 20.73,11.4 19.49,12.64 19.49,12.89 v18.98,13.4
  Bottom 0.152: JP3.1 14.61,16 16.95,13.65 18.73,13.65 v18.98,13.4
SCK  (via drill 0.25)
  Top 0.152: U3.14 24.96,14.82 v25.28,15.14 | v26.08,18.54 25.44,19.18 U4.6
  Bottom 0.152: v25.28,15.14 26.08,15.94 v26.08,18.54
SCL  (via drill 0.25)
  Top 0.152: v44.53,15.32 JP1.8 | v44.53,15.32 44.03,14.82 44.03,13.45 43.9,13.31 41.72,13.31 41.26,12.85 38.27,12.85 37.61,12.19 36.95,12.19 36.41,12.73 34.72,12.73 34.56,12.57 U5.16 31.83,12.57 31.32,13.08 30.15,13.08 v29.97,13.26 | U6.6 38.73,20.02 41.37,17.38 41.37,17.26 41.61,17.02 43.94,17.02 44.53,16.43 v44.53,15.32 | R2.2 17.63,13.64 20.12,11.15 20.12,9.65 21.19,8.58 U3.22 22.51,8.58 23.63,9.7 24.39,9.7 v24.57,9.88
  Bottom 0.152: JP2.4 44.17,15.68 v44.53,15.32 | v24.57,9.88 27.95,13.26 v29.97,13.26
SDA  (via drill 0.25)
  Top 0.152: U6.5 40.01,19.43 v40.13,19.3 | v37.34,12.7 36.87,12.7 36.47,13.1 34.24,13.1 U5.15 32.38,13.84 32,14.22 v29.97,14.22 | JP1.7 44.67,14.32 v44.51,14.48 | R2.3 18.44,13.26 20.42,11.28 20.42,9.8 20.85,9.38 U3.21 22.59,9.38 v23.45,10.24
  Bottom 0.152: v37.34,12.7 40.13,15.49 | 40.13,15.49 v40.13,19.3 | v44.51,14.48 44.45,14.48 | 44.45,14.48 41.15,14.48 40.13,15.49 | JP2.3 43.17,15.76 44.45,14.48 | v23.45,10.24 27.43,14.22 v29.97,14.22
SHIELD  (via drill 0.25)
  Top 0.152: R9.2 5.65,2.29 | 5.65,2.29 C13.2 6.67,3.39 6.13,3.92 6.13,7.33 5.99,7.47 4.74,7.47 J2.S2 | 5.65,2.29 v5.59,2.29 | J2.S5 J2.S3 J2.S4 J2.S6 3.87,14.73 J2.S1
  Bottom 0.152: J2.S5 1.52,6.51 5.59,2.45 v5.59,2.29
STAT  (via drill 0.25)
  Top 0.152: U2.1 11.38,9.46 v10.95,9.9 | R5.2 4.13,6.54 v3.81,6.86
  Bottom 0.152: v10.95,9.9 4.31,9.9 3.05,8.64 3.05,7.62 v3.81,6.86
SWCLK_NEOPIX  (via drill 0.25)
  Top 0.152: 28.19,4.57 27.84,4.22 27.84,2.58 27.4,2.15 NEOPIX.1 27.26,1.62 v26.64,1.62 | 28.19,4.57 28.19,5.57 U3.31 | 28.19,4.57 28.67,4.57 29.25,4.57 v29.72,4.57 | R7.2 30.73,19.75 v30.73,18.03
  Bottom 0.152: TP6.P$1 8.42,8.38 9.65,7.15 11.13,7.15 16.67,1.62 v26.64,1.62 | v29.72,4.57 30.73,5.59 30.71,5.61 29.77,5.61 29.49,5.9 29.49,6.3 31.47,8.28 31.47,14.93 30.73,15.67 v30.73,18.03
SWDIO_BTN1  (via drill 0.25)
  Top 0.152: v27.88,7.32 28.96,6.23 U3.32 30.62,5.6 32.62,3.59 33.74,3.59 34.8,2.54 34.8,1.23 | v17.15,9.34 17.08,9.42 v17.08,11.58 | SW3.3 34.8,1.23 | 34.8,1.23 SW3.1
  Bottom 0.152: v27.88,7.32 27.76,7.44 27.07,7.44 26.66,7.04 21.67,7.04 17.12,11.58 v17.08,11.58 | TP7.P$1 16.45,9.34 v17.15,9.34
TX  (via drill 0.25)
  Top 0.152: U3.19 22.75,10.98 v23.41,11.64
  Bottom 0.152: v23.41,11.64 16,19.05 8.13,19.05 6.99,20.19 JP3.8
USB_N  (via drill 0.25)
  Top 0.152: U3.23 20.99,7.78 v20.57,7.37 | v5.84,12.19 5.73,12.08 J2.2
  Bottom 0.152: v20.57,7.37 15.75,12.19 v5.84,12.19
USB_P  (via drill 0.25)
  Top 0.152: v20.57,6.6 20.95,6.98 U3.24 | v5.84,11.43 J2.3
  Bottom 0.152: v20.57,6.6 15.75,11.43 v5.84,11.43
V+  (via drill 0.3)
  Top 0.305: Q1.2 16.24,9.33 17.26,8.32 17.26,6.84 v15.42,5 13.9,3.49 U1.1 10.78,3.49 C1.1 10.18,3.49 9.32,4.36 8.89,4.36 8.34,4.91 8.34,6.55 7.34,7.55 R3.1 D1.C | R1.6 14.44,5.94 v14.44,5.98
  Bottom 0.305: v15.42,5 v14.44,5.98
VBACKUP  (via drill 0.25)
  Top 0.152: U6.3 38.73,17.14 38.61,17.27 35.8,17.27 35.67,17.14 35.67,16.36 34.54,15.24 33.63,15.24 U5.14 31.37,15.11 v30.99,14.73
  Bottom 0.152: B2.+ 25.4,4.16 28.53,7.29 28.53,8.72 30.99,11.18 v30.99,14.73
VBAT
  Top 0.305: R1.1 10.29,8.64 10.29,10.54 11.11,11.36 11.68,11.36 | 11.68,11.36 U2.3 13.72,11.36 C4.1 14.39,11.33 14.39,8.79 Q1.3 | J1.2 11.79,11.47 11.68,11.36
VBUS  (via drill 0.3)
  Top 0.305: CHG.A 1.62,5.59 2.79,6.76 2.79,11.98 3.54,12.73 J2.1 5.36,12.73 6.42,13.79 D1.A 9.37,11.53 U2.4 9.37,10.7 v9.55,10.52 | v14.99,9.91 15.24,9.65 15.24,8.64 16.19,7.69 Q1.1 16.24,6.65 13.91,4.32 12.19,4.32 11.38,5.13 R1.4
  Bottom 0.305: v14.99,9.91 14.96,9.93 11.79,9.93 11.24,10.48 9.58,10.48 v9.55,10.52
VDDCORE
  Top 0.152: U3.29 26.56,4.72 25.33,3.49 C6.1
XIN32
  Top 0.152: U3.1 30.87,6.98 32,5.84 32.45,5.84 X1.1 33.34,5.07 C9.1
XIN_RTC
  Top 0.152: U6.1 36.2,15.11 36.89,14.42 X2.1 35.59,13.97 C11.1
XOUT32
  Top 0.152: U3.2 30.96,7.78 31.93,6.8 X1.4 33.34,7.63 C10.1
XOUT_RTC
  Top 0.152: U6.2 37.47,14.86 37.79,14.54 X2.4 39.08,13.97 C12.1

### Text on the board
tPlace: The / Sensor Cap
bPlace: Power to 9-Pin / Connector | PA18/TX | GND | 3V3 AVCC | < ESP-01 / Module | 3V3 | PA16 | PA17 | PA19/RX | Road to the Book / #7 / The Sensor Cap / OSO-SCAP-A1-00 | by joey castillo / @josecastillo / CC-BY-SA 4.0 | RESET | SWCLK | 3V3 | GND | SWDIO | Four options for RTC: | $$$: DS3231 in U5; DNP X1-X2 or C9-C12 / $$: PCF8523 in U4; DNP X1 or C9-C12 / $$: MCP7940N in U4; DNP X1, C9-C10 / $: ZeroRTC. No battery backup. DNP U4, / U5, X2 or C11-C12 | OFF | ON